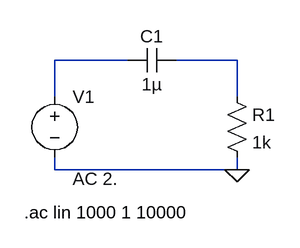
[diagram p0: schematic High_Pass_voltage.asc]
High_Pass_voltage.asc, the LTspice schematic file:
Version 4.1
SHEET 1 880 680
WIRE 176 64 80 64
WIRE 320 64 240 64
WIRE 80 112 80 64
WIRE 320 112 320 64
WIRE 80 208 80 192
WIRE 320 208 320 192
WIRE 320 208 80 208
FLAG 320 208 0
SYMBOL voltage 80 96 R0
WINDOW 123 24 124 Left 2
WINDOW 39 0 0 Left 0
SYMATTR Value2 AC 2.
SYMATTR InstName V1
SYMATTR Value ""
SYMBOL res 304 96 R0
SYMATTR InstName R1
SYMATTR Value 1k
SYMBOL cap 240 48 R90
WINDOW 0 0 32 VBottom 2
WINDOW 3 32 32 VTop 2
SYMATTR InstName C1
SYMATTR Value 1µ
TEXT 40 264 Left 2 !.ac lin 1000 1 10000

The netlist it stands for:
* High_Pass_voltage.asc
V1 N001 0 AC 2.
R1 N002 0 1k
C1 N002 N001 1µ
.ac lin 1000 1 10000
.backanno
.end